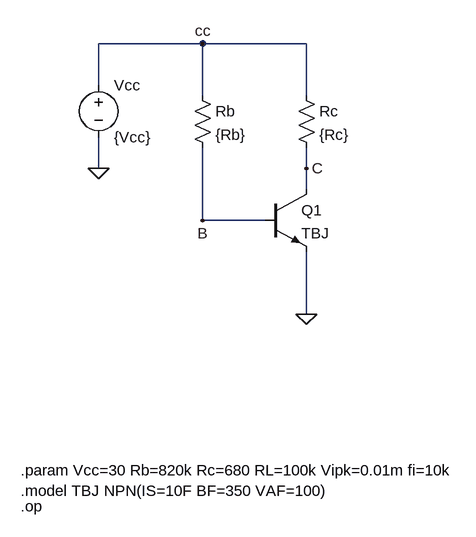
[diagram p0: schematic TBJ01CAop.asc]
TBJ01CAop.asc, the LTspice schematic file:
Version 4
SHEET 1 1608 1076
WIRE 128 -16 -32 -16
WIRE 288 -16 128 -16
WIRE -32 48 -32 -16
WIRE 128 64 128 -16
WIRE 288 64 288 -16
WIRE -32 176 -32 128
WIRE 288 176 288 144
WIRE 288 208 288 176
WIRE 128 256 128 144
WIRE 224 256 128 256
WIRE 288 400 288 304
FLAG -32 176 0
FLAG 288 400 0
FLAG 128 -16 cc
FLAG 128 256 B
FLAG 288 176 C
SYMBOL res 112 48 R0
SYMATTR InstName Rb
SYMATTR Value {Rb}
SYMBOL res 272 48 R0
SYMATTR InstName Rc
SYMATTR Value {Rc}
SYMBOL voltage -32 32 R0
WINDOW 123 0 0 Left 0
WINDOW 39 0 0 Left 0
SYMATTR InstName Vcc
SYMATTR Value {Vcc}
SYMBOL npn 224 208 R0
SYMATTR InstName Q1
SYMATTR Value TBJ
TEXT -152 640 Left 2 !.param Vcc=30 Rb=820k Rc=680 RL=100k Vipk=0.01m fi=10k
TEXT -152 696 Left 2 !.op
TEXT -152 672 Left 2 !.model TBJ NPN(IS=10F BF=350 VAF=100)

The netlist it stands for:
* TBJ01CAop.asc
Rb cc B {Rb}
Rc cc C {Rc}
Vcc cc 0 {Vcc}
Q1 C B 0 0 TBJ
.model NPN NPN
.model PNP PNP
.lib standard.bjt
.param Vcc=30 Rb=820k Rc=680 RL=100k Vipk=0.01m fi=10k
.op
.model TBJ NPN(IS=10F BF=350 VAF=100)
.backanno
.end